# EAGLE design probe (EAGLE 6.6.0)
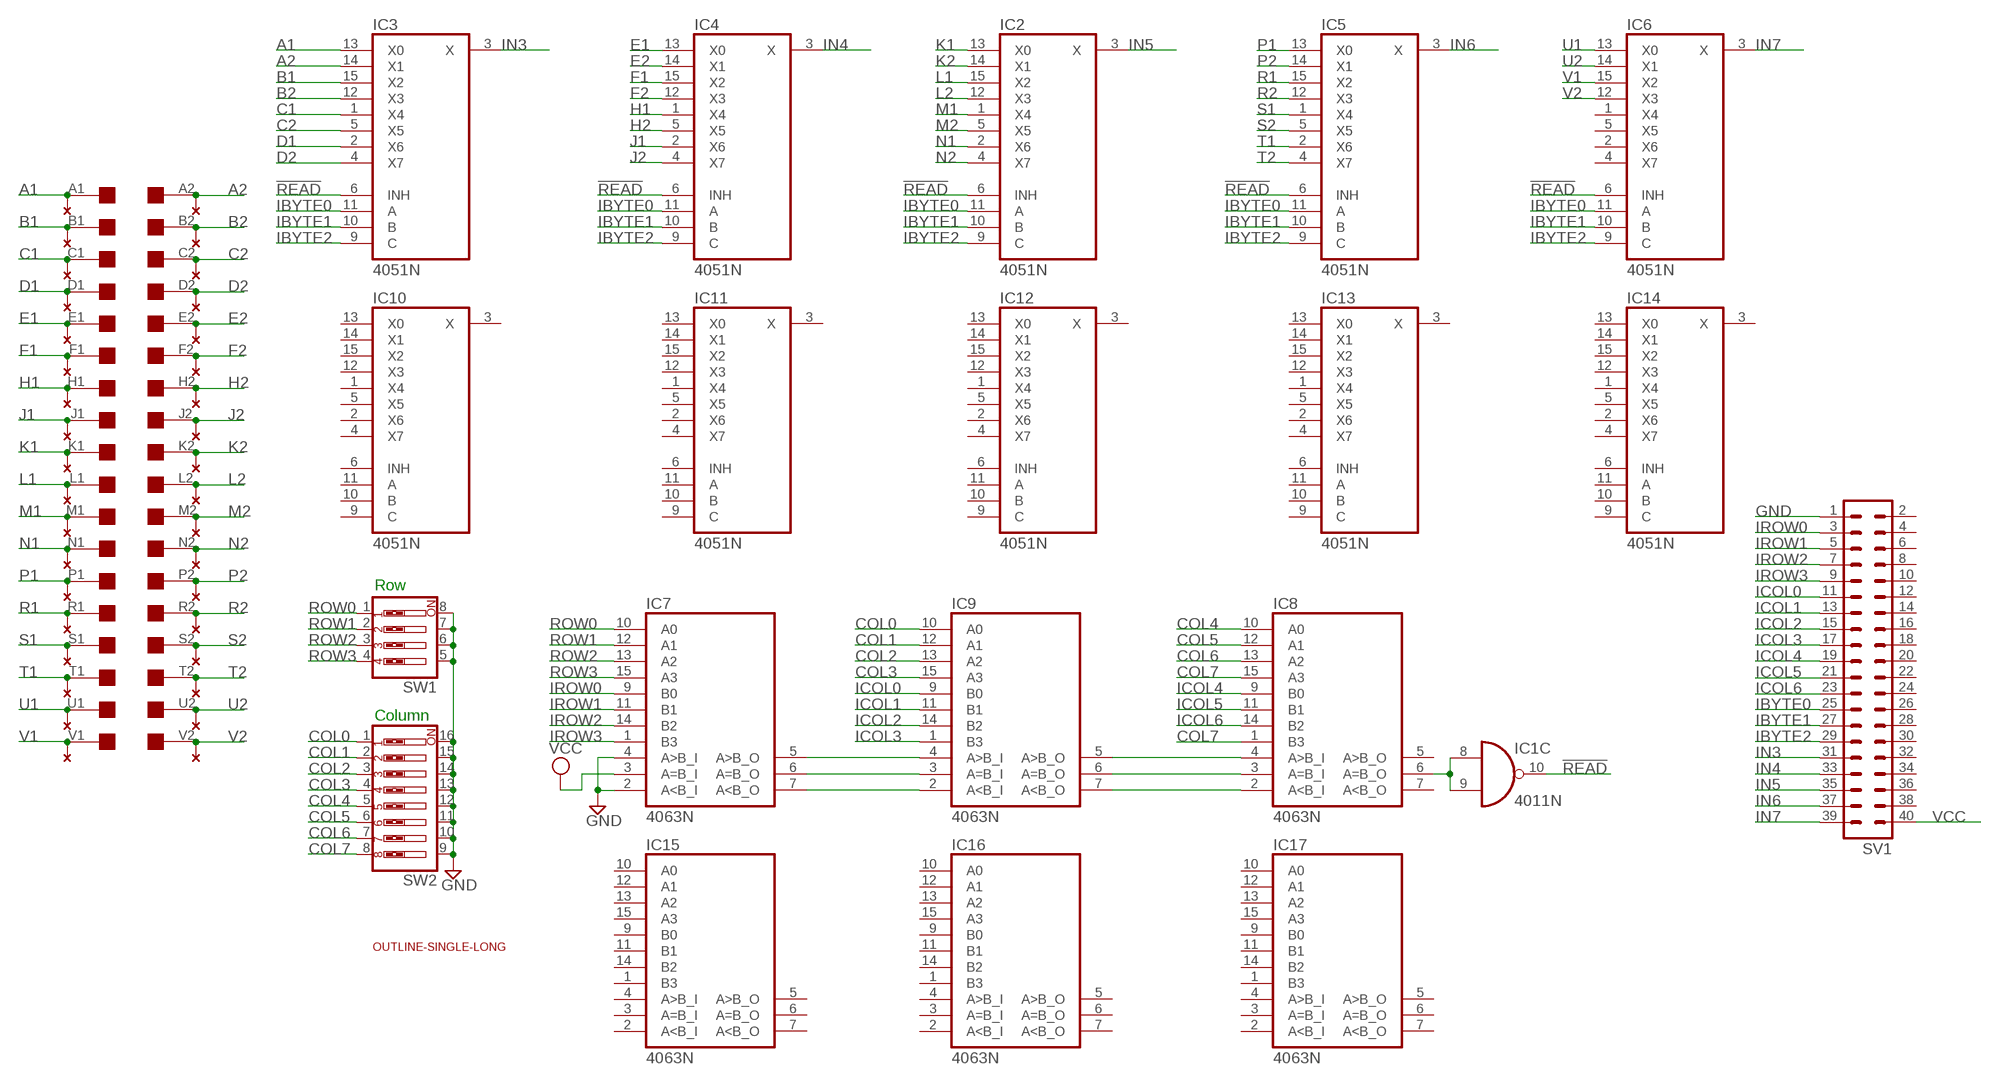
[diagram p0: schematic, sheet 1]

## Parts
EDGE1  EDGE-2CONNECTOR  [EDGE-CON2]
IC1  4011N  [DIL14]
IC2  4051N  [DIL16]
IC3  4051N  [DIL16]
IC4  4051N  [DIL16]
IC5  4051N  [DIL16]
IC6  4051N  [DIL16]
IC7  4063N  [DIL16]
IC8  4063N  [DIL16]
IC9  4063N  [DIL16]
IC10  4051N  [DIL16]
IC11  4051N  [DIL16]
IC12  4051N  [DIL16]
IC13  4051N  [DIL16]
IC14  4051N  [DIL16]
IC15  4063N  [DIL16]
IC16  4063N  [DIL16]
IC17  4063N  [DIL16]
SV1  MA20-2  [MA20-2]
SW1  SW_DIP-4  [EDG-04]
SW2  SW_DIP-8  [EDG-08]
U$1  OUTLINE-SINGLE-LONG  [SINGLE-LONG]
U$3  THRU-HOLE2  [THRU-HOLEB]

## Nets
!READ: IC1.10(C:O) IC2.6(INH) IC3.6(INH) IC4.6(INH) IC5.6(INH) IC6.6(INH)
A1: EDGE1.A1 IC3.13(X0) U$3.A1
A2: EDGE1.A2 IC3.14(X1) U$3.A2
B1: EDGE1.B1 IC3.15(X2) U$3.B1
B2: EDGE1.B2 IC3.12(X3) U$3.B2
C1: EDGE1.C1 IC3.1(X4) U$3.C1
C2: EDGE1.C2 IC3.5(X5) U$3.C2
COL0: IC9.10(A0) SW2.1
COL1: IC9.12(A1) SW2.2
COL2: IC9.13(A2) SW2.3
COL3: IC9.15(A3) SW2.4
COL4: IC8.10(A0) SW2.5
COL5: IC8.12(A1) SW2.6
COL6: IC8.13(A2) SW2.7
COL7: IC8.1(B3) IC8.15(A3) SW2.8
D1: EDGE1.D1 IC3.2(X6) U$3.D1
D2: EDGE1.D2 IC3.4(X7) U$3.D2
E1: EDGE1.E1 IC4.13(X0) U$3.E1
E2: EDGE1.E2 IC4.14(X1) U$3.E2
F1: EDGE1.F1 IC4.15(X2) U$3.F1
F2: EDGE1.F2 IC4.12(X3) U$3.F2
GND: IC7.2(A<B_I) IC7.4(A>B_I) SV1.1 SW1.5 SW1.6 SW1.7 SW1.8 SW2.9 SW2.10 SW2.11 SW2.12 SW2.13 SW2.14 SW2.15 SW2.16
H1: EDGE1.H1 IC4.1(X4) U$3.H1
H2: EDGE1.H2 IC4.5(X5) U$3.H2
IBYTE0: IC2.11(A) IC3.11(A) IC4.11(A) IC5.11(A) IC6.11(A) SV1.25
IBYTE1: IC2.10(B) IC3.10(B) IC4.10(B) IC5.10(B) IC6.10(B) SV1.27
IBYTE2: IC2.9(C) IC3.9(C) IC4.9(C) IC5.9(C) IC6.9(C) SV1.29
ICOL0: IC9.9(B0) SV1.11
ICOL1: IC9.11(B1) SV1.13
ICOL2: IC9.14(B2) SV1.15
ICOL3: IC9.1(B3) SV1.17
ICOL4: IC8.9(B0) SV1.19
ICOL5: IC8.11(B1) SV1.21
ICOL6: IC8.14(B2) SV1.23
IN3: IC3.3(X) SV1.31
IN4: IC4.3(X) SV1.33
IN5: IC2.3(X) SV1.35
IN6: IC5.3(X) SV1.37
IN7: IC6.3(X) SV1.39
IROW0: IC7.9(B0) SV1.3
IROW1: IC7.11(B1) SV1.5
IROW2: IC7.14(B2) SV1.7
IROW3: IC7.1(B3) SV1.9
J1: EDGE1.J1 IC4.2(X6) U$3.J1
J2: EDGE1.J2 IC4.4(X7) U$3.J2
K1: EDGE1.K1 IC2.13(X0) U$3.K1
K2: EDGE1.K2 IC2.14(X1) U$3.K2
L1: EDGE1.L1 IC2.15(X2) U$3.L1
L2: EDGE1.L2 IC2.12(X3) U$3.L2
M1: EDGE1.M1 IC2.1(X4) U$3.M1
M2: EDGE1.M2 IC2.5(X5) U$3.M2
N1: EDGE1.N1 IC2.2(X6) U$3.N1
N2: EDGE1.N2 IC2.4(X7) U$3.N2
N$1: IC7.5(A>B_O) IC9.4(A>B_I)
N$2: IC7.6(A=B_O) IC9.3(A=B_I)
N$3: IC7.7(A<B_O) IC9.2(A<B_I)
N$4: IC1.8(C:I0) IC1.9(C:I1) IC8.6(A=B_O)
N$5: IC8.4(A>B_I) IC9.5(A>B_O)
N$6: IC8.3(A=B_I) IC9.6(A=B_O)
N$7: IC8.2(A<B_I) IC9.7(A<B_O)
P1: EDGE1.P1 IC5.13(X0) U$3.P1
P2: EDGE1.P2 IC5.14(X1) U$3.P2
R1: EDGE1.R1 IC5.15(X2) U$3.R1
R2: EDGE1.R2 IC5.12(X3) U$3.R2
ROW0: IC7.10(A0) SW1.1
ROW1: IC7.12(A1) SW1.2
ROW2: IC7.13(A2) SW1.3
ROW3: IC7.15(A3) SW1.4
S1: EDGE1.S1 IC5.1(X4) U$3.S1
S2: EDGE1.S2 IC5.5(X5) U$3.S2
T1: EDGE1.T1 IC5.2(X6) U$3.T1
T2: EDGE1.T2 IC5.4(X7) U$3.T2
U1: EDGE1.U1 IC6.13(X0) U$3.U1
U2: EDGE1.U2 IC6.14(X1) U$3.U2
V1: EDGE1.V1 IC6.15(X2) U$3.V1
V2: EDGE1.V2 IC6.12(X3) U$3.V2
VCC: IC7.3(A=B_I) SV1.40
Unconnected: IC1.1(A:I0) IC1.2(A:I1) IC1.3(A:O) IC1.4(B:O) IC1.5(B:I0) IC1.6(B:I1) IC1.11(D:O) IC1.12(D:I0) IC1.13(D:I1) IC6.1(X4) IC6.2(X6) IC6.4(X7) IC6.5(X5) IC8.5(A>B_O) IC8.7(A<B_O) IC10.1(X4) IC10.2(X6) IC10.3(X) IC10.4(X7) IC10.5(X5) IC10.6(INH) IC10.9(C) IC10.10(B) IC10.11(A) IC10.12(X3) IC10.13(X0) IC10.14(X1) IC10.15(X2) IC11.1(X4) IC11.2(X6) IC11.3(X) IC11.4(X7) IC11.5(X5) IC11.6(INH) IC11.9(C) IC11.10(B) IC11.11(A) IC11.12(X3) IC11.13(X0) IC11.14(X1) IC11.15(X2) IC12.1(X4) IC12.2(X6) IC12.3(X) IC12.4(X7) IC12.5(X5) IC12.6(INH) IC12.9(C) IC12.10(B) IC12.11(A) IC12.12(X3) IC12.13(X0) IC12.14(X1) IC12.15(X2) IC13.1(X4) IC13.2(X6) IC13.3(X) IC13.4(X7) IC13.5(X5) IC13.6(INH) IC13.9(C) IC13.10(B) IC13.11(A) IC13.12(X3) IC13.13(X0) IC13.14(X1) IC13.15(X2) IC14.1(X4) IC14.2(X6) IC14.3(X) IC14.4(X7) IC14.5(X5) IC14.6(INH) IC14.9(C) IC14.10(B) IC14.11(A) IC14.12(X3) IC14.13(X0) IC14.14(X1) IC14.15(X2) IC15.1(B3) IC15.2(A<B_I) IC15.3(A=B_I) IC15.4(A>B_I) IC15.5(A>B_O) IC15.6(A=B_O) IC15.7(A<B_O) IC15.9(B0) IC15.10(A0) IC15.11(B1) IC15.12(A1) IC15.13(A2) IC15.14(B2) IC15.15(A3) IC16.1(B3) IC16.2(A<B_I) IC16.3(A=B_I) IC16.4(A>B_I) IC16.5(A>B_O) IC16.6(A=B_O) IC16.7(A<B_O) IC16.9(B0) IC16.10(A0) IC16.11(B1) IC16.12(A1) IC16.13(A2) IC16.14(B2) IC16.15(A3) IC17.1(B3) IC17.2(A<B_I) IC17.3(A=B_I) IC17.4(A>B_I) IC17.5(A>B_O) IC17.6(A=B_O) IC17.7(A<B_O) IC17.9(B0) IC17.10(A0) IC17.11(B1) IC17.12(A1) IC17.13(A2) IC17.14(B2) IC17.15(A3) SV1.2 SV1.4 SV1.6 SV1.8 SV1.10 SV1.12 SV1.14 SV1.16 SV1.18 SV1.20 SV1.22 SV1.24 SV1.26 SV1.28 SV1.30 SV1.32 SV1.34 SV1.36 SV1.38

## Notes on the sheet
- Row
- Column

## Power pins joined to a net without a drawn wire
GND: IC2.8(GND) IC3.8(GND) IC4.8(GND) IC5.8(GND) IC6.8(GND) IC10.8(GND) IC11.8(GND) IC12.8(GND) IC13.8(GND) IC14.8(GND)
VCC: IC2.16(VCC) IC3.16(VCC) IC4.16(VCC) IC5.16(VCC) IC6.16(VCC) IC10.16(VCC) IC11.16(VCC) IC12.16(VCC) IC13.16(VCC) IC14.16(VCC)
VDD: IC1.14(P:VDD) IC7.16(VDD) IC8.16(VDD) IC9.16(VDD) IC15.16(VDD) IC16.16(VDD) IC17.16(VDD)
VEE: IC2.7(VEE) IC3.7(VEE) IC4.7(VEE) IC5.7(VEE) IC6.7(VEE) IC10.7(VEE) IC11.7(VEE) IC12.7(VEE) IC13.7(VEE) IC14.7(VEE)
VSS: IC1.7(P:VSS) IC7.8(VSS) IC8.8(VSS) IC9.8(VSS) IC15.8(VSS) IC16.8(VSS) IC17.8(VSS)

## Library data of the parts
EDGE1 = dec-con:EDGE-2: Double-Sided DEC edge connector.
IC1 = 40xx:4011: Quad 2-input NAND
IC2-IC6 IC10-IC14 = 40xx:4051: 8-channel ANALOG MULTIPLEXER
IC7-IC9 IC15-IC17 = 40xx:4063: 4-bit magnitude COMPARATOR
SV1 = con-lstb:MA20-2: PIN HEADER; OC_FARNELL: unknown; OC_NEWARK: unknown
SW1 = special:SW_DIP-4: DIP SWITCH
SW2 = special:SW_DIP-8: DIP SWITCH
U$1 = dec-con:OUTLINE-*: Board outlines for DEC boards.
U$3 = dec-con:THRU-HOLE2: Thru-Hole addition to double-sided edge connector.

## Board
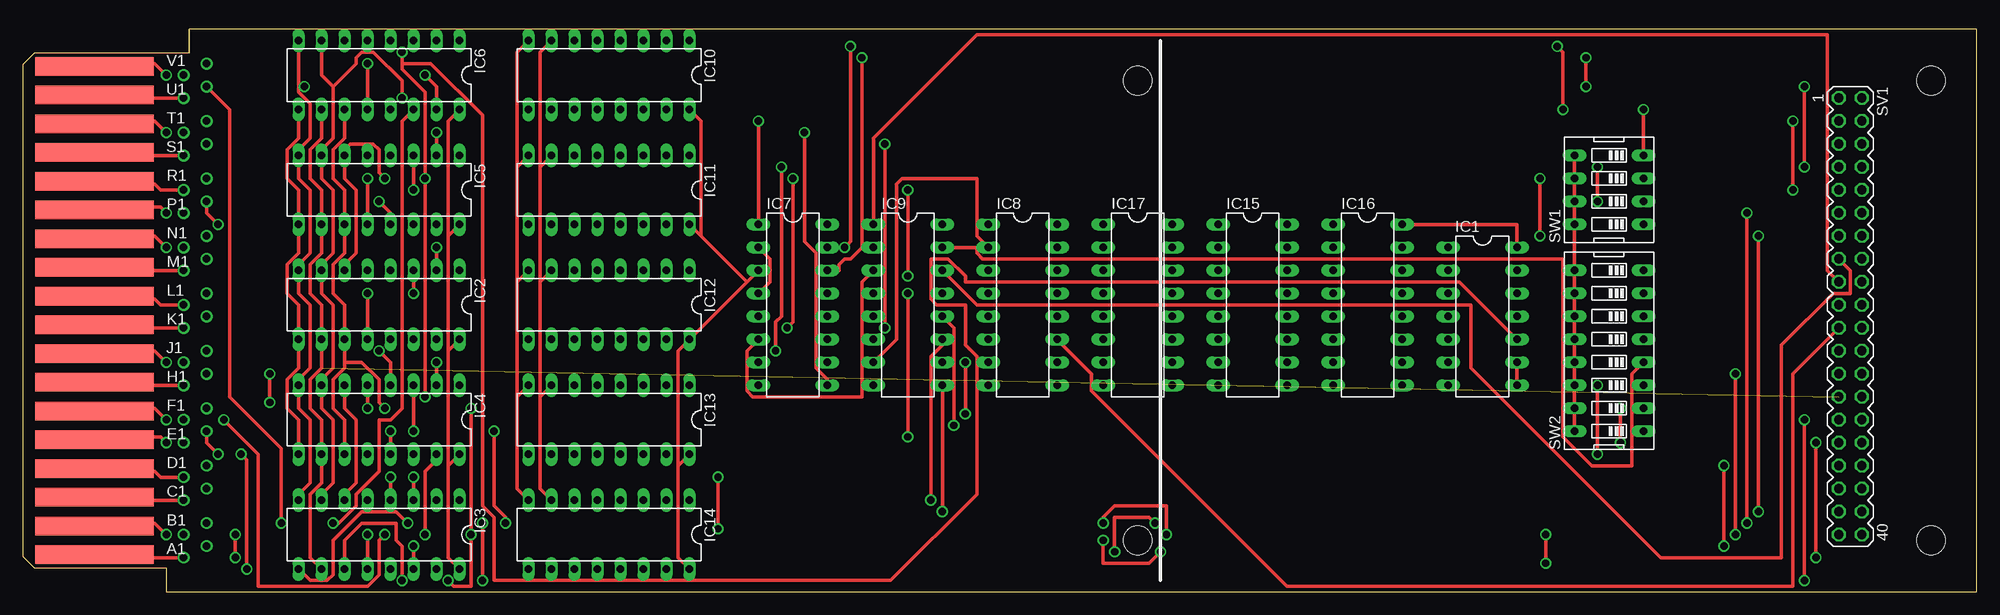
[diagram p1: board, top side]
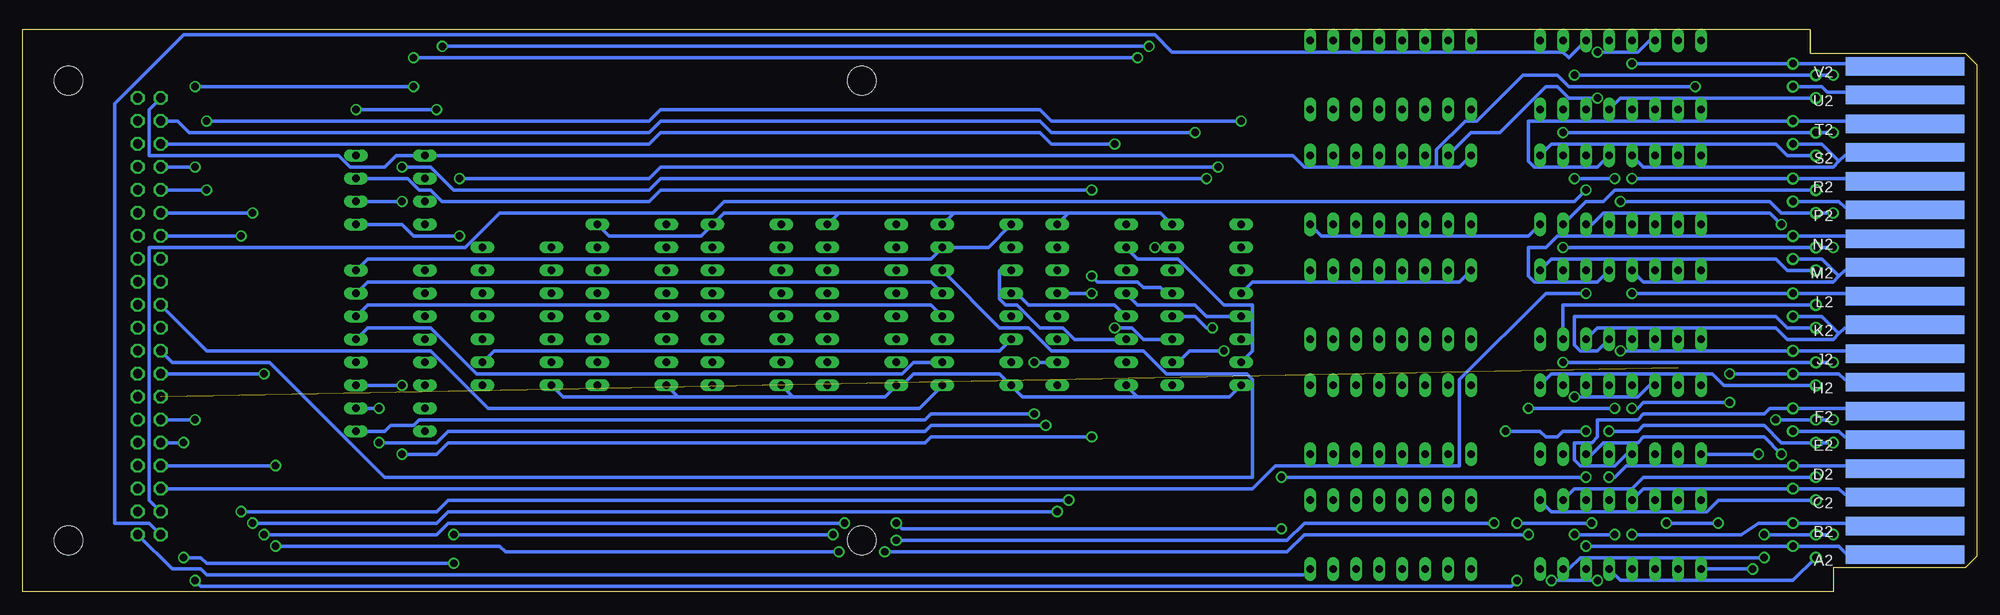
[diagram p2: board, bottom side, seen from below]

Size 215.9 x 62.23 mm. Coordinates in mm from the lower left corner, seen from the top.
Copper layers (1+16): Top 0.035mm / dielectric 1.5mm / Bottom 0.035mm
Design rules "16mils": minimum track width 16mil, minimum drill 32mil, track to track 15mil, track to pad 10mil, pad to pad 10mil, via to via 10mil, smd to smd 10mil, copper to edge 13mil, drill to drill 10mil, minimum pad ring 10mil, minimum via ring 8mil, stop-mask expansion 0mil, vias tented up to drill 0mil, thermal gap 10mil
Holes 3.17 mm at 123.19,56.52 123.19,5.71

### Footprints (pad centres in the part's own frame; a part is rotated, then mirrored left to right if it is on the bottom)
EDGE-CON2 = smd 13.106 x 2.032: A1 7.938,4.128; B1 7.938,7.303; C1 7.938,10.477; D1 7.938,13.652; E1 7.938,16.828; F1 7.938,20.003; H1 7.938,23.177; J1 7.938,26.352; K1 7.938,29.527; L1 7.938,32.703; M1 7.938,35.877; N1 7.938,39.053; P1 7.938,42.227; R1 7.938,45.403; S1 7.938,48.578; T1 7.938,51.752; U1 7.938,54.928; V1 7.938,58.102 | smd 13.106 x 2.032 bottom: A2 7.938,4.128; B2 7.938,7.303; C2 7.938,10.477; D2 7.938,13.652; E2 7.938,16.828; F2 7.938,20.003; H2 7.938,23.177; J2 7.938,26.352; K2 7.938,29.527; L2 7.938,32.703; M2 7.938,35.877; N2 7.938,39.053; P2 7.938,42.227; R2 7.938,45.403; S2 7.938,48.578; T2 7.938,51.752; U2 7.938,54.928; V2 7.938,58.102
DIL14 = drill 0.813 long: 1 -7.62,-3.81; 2 -5.08,-3.81; 3 -2.54,-3.81; 4 0,-3.81; 5 2.54,-3.81; 6 5.08,-3.81; 7 7.62,-3.81; 8 7.62,3.81; 9 5.08,3.81; 10 2.54,3.81; 11 0,3.81; 12 -2.54,3.81; 13 -5.08,3.81; 14 -7.62,3.81
DIL16 = drill 0.813 long: 1 -8.89,-3.81; 2 -6.35,-3.81; 3 -3.81,-3.81; 4 -1.27,-3.81; 5 1.27,-3.81; 6 3.81,-3.81; 7 6.35,-3.81; 8 8.89,-3.81; 9 8.89,3.81; 10 6.35,3.81; 11 3.81,3.81; 12 1.27,3.81; 13 -1.27,3.81; 14 -3.81,3.81; 15 -6.35,3.81; 16 -8.89,3.81
MA20-2 = drill 1.016 octagon: 1 -24.13,-1.27; 2 -24.13,1.27; 3 -21.59,-1.27; 4 -21.59,1.27; 5 -19.05,-1.27; 6 -19.05,1.27; 7 -16.51,-1.27; 8 -16.51,1.27; 9 -13.97,-1.27; 10 -13.97,1.27; 11 -11.43,-1.27; 12 -11.43,1.27; 13 -8.89,-1.27; 14 -8.89,1.27; 15 -6.35,-1.27; 16 -6.35,1.27; 17 -3.81,-1.27; 18 -3.81,1.27; 19 -1.27,-1.27; 20 -1.27,1.27; 21 1.27,-1.27; 22 1.27,1.27; 23 3.81,-1.27; 24 3.81,1.27; 25 6.35,-1.27; 26 6.35,1.27; 27 8.89,-1.27; 28 8.89,1.27; 29 11.43,-1.27; 30 11.43,1.27; 31 13.97,-1.27; 32 13.97,1.27; 33 16.51,-1.27; 34 16.51,1.27; 35 19.05,-1.27; 36 19.05,1.27; 37 21.59,-1.27; 38 21.59,1.27; 39 24.13,-1.27; 40 24.13,1.27
EDG-04 = drill 0.813 long: 1 -3.81,-3.81; 2 -1.27,-3.81; 3 1.27,-3.81; 4 3.81,-3.81; 5 3.81,3.81; 6 1.27,3.81; 7 -1.27,3.81; 8 -3.81,3.81
EDG-08 = drill 0.813 long: 1 -8.89,-3.81; 2 -6.35,-3.81; 3 -3.81,-3.81; 4 -1.27,-3.81; 5 1.27,-3.81; 6 3.81,-3.81; 7 6.35,-3.81; 8 8.89,-3.81; 9 8.89,3.81; 10 6.35,3.81; 11 3.81,3.81; 12 1.27,3.81; 13 -1.27,3.81; 14 -3.81,3.81; 15 -6.35,3.81; 16 -8.89,3.81
SINGLE-LONG = hole 3.175: 210.82,56.515; 210.82,5.715
THRU-HOLEB = drill 0.813 pad 1.27: A1 17.78,3.81; A2 20.32,5.08; B1 17.78,6.35; B2 20.32,7.62; C1 17.78,10.16; C2 20.32,11.43; D1 17.78,12.7; D2 20.32,13.97; E1 17.78,16.51; E2 20.32,17.78; F1 17.78,19.05; F2 20.32,20.32; H1 17.78,22.86; H2 20.32,24.13; J1 17.78,25.4; J2 20.32,26.67; K1 17.78,29.21; K2 20.32,30.48; L1 17.78,31.75; L2 20.32,33.02; M1 17.78,35.56; M2 20.32,36.83; N1 17.78,38.1; N2 20.32,39.37; P1 17.78,41.91; P2 20.32,43.18; R1 17.78,44.45; R2 20.32,45.72; S1 17.78,48.26; S2 20.32,49.53; T1 17.78,50.8; T2 20.32,52.07; U1 17.78,54.61; U2 20.32,55.88; V1 17.78,57.15; V2 20.32,58.42

### Placement (x,y rotation side)
EDGE1  0,0 0 top
IC1  161.29,30.48 270 top
IC2  39.37,31.75 180 top
IC3  39.37,6.35 180 top
IC4  39.37,19.05 180 top
IC5  39.37,44.45 180 top
IC6  39.37,57.15 180 top
IC7  85.09,31.75 270 top
IC8  110.49,31.75 270 top
IC9  97.79,31.75 270 top
IC10  64.77,57.15 180 top
IC11  64.77,44.45 180 top
IC12  64.77,31.75 180 top
IC13  64.77,19.05 180 top
IC14  64.77,6.35 180 top
IC15  135.89,31.75 270 top
IC16  148.59,31.75 270 top
IC17  123.19,31.75 270 top
SV1  201.93,30.48 270 top
SW1  175.26,44.45 90 top
SW2  175.26,26.67 90 top
U$1  0,0 0 top
U$3  0,0 0 top

### Tracks (layer width: path | path; a pad name or v marks a point on that pad's centre or on a via)
!READ  (via drill 0.81)
  Top 0.406: IC3.6 35.56,10.79 36.83,12.06 36.83,19.05 35.56,20.32 IC4.6 | IC2.6 35.56,36.2 36.83,37.47 36.83,44.45 35.56,45.72 IC5.6 35.56,48.9 36.2,49.53 38.74,49.53 39.37,48.9 39.37,46.35 v40.01,45.72 | 41.91,58.42 41.91,57.78 44.45,55.24 v44.45,45.72 v44.45,21.59 | 41.91,58.42 v41.91,59.69 | IC1.10 158.75,34.29 104.14,34.29 104.14,34.92 102.24,36.83 100.33,36.83 100.33,32.38 100.97,31.75 104.14,31.75 104.14,27.3 105.41,26.04 105.41,10.79 95.89,1.27 52.07,1.27 52.07,8.26 50.8,9.53 50.8,52.7 45.09,58.42 41.91,58.42
  Bottom 0.406: IC6.6 36.2,60.96 37.47,59.69 v41.91,59.69 | v40.01,45.72 v44.45,45.72 | IC4.6 36.2,22.86 37.47,21.59 v44.45,21.59
A1
  Top 0.406: U$3.A1 8.26,3.81 EDGE1.A1
  Bottom 0.406: IC3.13 39.37,1.27 20.32,1.27 U$3.A1
A2  (via drill 0.81)
  Top 0.406: v43.18,5.08 IC3.14
  Bottom 0.406: EDGE1.A2 8.26,3.81 13.97,3.81 15.24,5.08 U$3.A2 v43.18,5.08
B1  (via drill 0.81)
  Top 0.406: v15.88,6.35 14.61,7.62 8.26,7.62 EDGE1.B1 | v23.5,6.35 v23.5,3.81
  Bottom 0.406: v15.88,6.35 U$3.B1 v23.5,6.35 | IC3.15 45.09,2.54 43.82,3.81 v23.5,3.81
B2  (via drill 0.81)
  Top 0.406: v38.1,6.35 IC3.12
  Bottom 0.406: EDGE1.B2 8.26,7.62 U$3.B2 24.13,7.62 26.04,6.35 v38.1,6.35
C1
  Top 0.406: U$3.C1 8.26,10.16 EDGE1.C1
  Bottom 0.406: IC3.1 46.99,8.89 29.85,8.89 28.58,10.16 U$3.C1
C2
  Bottom 0.406: IC3.5 36.83,11.43 U$3.C2 15.24,11.43 14.61,10.79 8.26,10.79 EDGE1.C2
COL0  (via drill 0.81)
  Top 0.406: v104.14,19.68 v104.14,25.4
  Bottom 0.406: v104.14,25.4 IC9.10 | v104.14,19.68 115.57,19.68 116.21,19.05 172.09,19.05 172.72,18.41 175.26,18.41 175.9,17.78 SW2.1
COL1  (via drill 0.81)
  Top 0.406: IC9.12 102.87,29.21 v102.87,18.41 | v176.53,20.32 v176.53,16.51
  Bottom 0.406: v102.87,18.41 115.57,18.41 116.21,17.78 168.91,17.78 170.18,16.51 v176.53,16.51 | SW2.2 v176.53,20.32
COL2  (via drill 0.81)
  Top 0.406: v97.79,17.14 v97.79,33.02 | v173.99,22.86 v173.99,15.24
  Bottom 0.406: v97.79,33.02 IC9.13 | v97.79,17.14 115.57,17.14 116.21,16.51 168.91,16.51 170.18,15.24 v173.99,15.24 | SW2.3 v173.99,22.86
COL3
  Top 0.406: IC9.15 105.41,38.1 105.41,37.47 106.05,36.83 170.18,36.83 170.18,17.14 173.36,13.97 177.8,13.97 177.8,24.13 SW2.4
COL4
  Bottom 0.406: IC8.10 117.48,25.4 118.75,24.13 165.74,24.13 170.82,29.21 177.8,29.21 SW2.5
COL5
  Bottom 0.406: IC8.12 115.57,31.75 177.8,31.75 SW2.6
COL6
  Bottom 0.406: IC8.13 115.57,34.29 177.8,34.29 SW2.7
COL7
  Bottom 0.406: IC8.1 109.22,38.1 IC8.15 115.57,36.83 177.8,36.83 SW2.8
D1
  Top 0.406: U$3.D1 15.24,12.7 14.61,13.34 8.26,13.34 EDGE1.D1
  Bottom 0.406: IC3.2 44.45,11.43 38.1,11.43 36.83,12.7 U$3.D1
D2  (via drill 0.81)
  Top 0.406: v40.64,12.7 IC3.4
  Bottom 0.406: EDGE1.D2 8.26,13.97 U$3.D2 38.74,13.97 40.01,12.7 v40.64,12.7
E1  (via drill 0.81)
  Top 0.406: v15.88,16.51 15.24,17.14 8.26,17.14 EDGE1.E1 | v40.64,17.78 IC4.13
  Bottom 0.406: v15.88,16.51 U$3.E1 21.59,16.51 23.5,18.41 36.83,18.41 37.47,17.78 v40.64,17.78
E2  (via drill 0.81)
  Top 0.406: v21.59,15.24 20.32,16.51 U$3.E2
  Bottom 0.406: U$3.E2 15.24,17.78 14.61,17.14 8.26,17.14 EDGE1.E2 | IC4.14 42.55,15.24 41.28,16.51 37.47,16.51 36.83,17.14 23.5,17.14 v21.59,15.24
F1  (via drill 0.81)
  Top 0.406: v15.88,19.05 14.61,20.32 8.26,20.32 EDGE1.F1 | IC4.15 45.72,14.61 44.45,13.34 v44.45,6.35 | v40.01,6.35 39.37,5.71 39.37,1.91 38.1,0.64 26.04,0.64 26.04,15.24 v22.23,19.05
  Bottom 0.406: v15.88,19.05 U$3.F1 v22.23,19.05 | v40.01,6.35 v44.45,6.35
F2
  Bottom 0.406: IC4.12 38.74,15.24 40.01,13.97 43.82,13.97 44.45,14.61 44.45,16.51 42.55,16.51 41.91,17.14 41.91,19.05 37.47,19.05 36.83,19.68 23.5,19.68 22.86,20.32 U$3.F2 8.26,20.32 EDGE1.F2
GND  (via drill 0.81)
  Top 0.406: IC3.8 30.48,10.79 31.75,12.06 31.75,19.05 30.48,20.32 IC4.8 30.48,23.5 31.75,24.77 31.75,31.75 30.48,33.02 IC2.8 30.48,36.2 31.75,37.47 31.75,44.45 30.48,45.72 IC5.8 30.48,48.9 31.75,50.16 31.75,53.98 30.48,55.24 30.48,55.88 | 30.48,55.88 IC6.8 | v31.12,55.88 30.48,55.88 | SW2.16 SW2.15 SW2.14 SW2.13 SW2.12 SW2.11 SW2.10 SW2.9 SW1.8 SW1.7 SW1.6 SW1.5 | IC7.4 82.55,34.29 82.55,36.83 IC7.2 | IC14.8 54.61,11.43 54.61,21.59 | IC13.8 54.61,21.59 | 54.61,34.29 IC12.8 | 54.61,21.59 54.61,34.29 | 54.61,46.99 IC11.8 | 54.61,34.29 54.61,46.99 | IC10.8 54.61,59.69 54.61,46.99
  Bottom 0.406: v31.12,55.88 45.09,55.88 46.36,57.15 50.17,57.15 55.25,52.07 56.52,52.07 59.69,48.9 59.69,46.99 | SV1.1 201.93,53.34 201.93,48.26 180.98,48.26 179.71,46.99 175.9,46.99 174.63,48.26 SW1.5 75.57,48.26 74.3,46.99 59.69,46.99 | IC7.4 80.01,34.29 57.15,34.29 IC12.8 | 59.69,46.99 57.15,46.99 IC11.8
H1
  Top 0.406: U$3.H1 8.26,22.86 EDGE1.H1
  Bottom 0.406: IC4.1 46.99,24.13 29.21,24.13 27.94,22.86 U$3.H1
H2  (via drill 0.81)
  Top 0.406: v38.1,20.32 IC4.5 | v27.31,24.13 v27.31,20.95
  Bottom 0.406: EDGE1.H2 8.26,23.5 14.61,23.5 15.24,24.13 U$3.H2 v27.31,24.13 | v38.1,20.32 37.47,20.32 36.83,20.95 v27.31,20.95
IBYTE0  (via drill 0.81)
  Top 0.406: IC6.11 35.56,50.16 34.29,48.9 34.29,45.72 35.56,44.45 IC5.11 35.56,37.47 34.29,36.2 34.29,33.02 35.56,31.75 IC2.11 35.56,25.4 | IC3.11 35.56,5.71 37.47,7.62 41.28,7.62 41.28,5.71 41.91,5.08 v41.91,1.27 | v46.99,1.27 47.63,0.64 49.53,0.64 v49.53,6.35 v49.53,20.32 | v40.01,20.32 39.37,20.95 39.37,23.5 37.47,25.4 35.56,25.4 | IC4.11 35.56,19.05 34.29,20.32 34.29,23.5 35.56,24.77 35.56,25.4 | v189.23,6.35 v189.23,24.13 | v125.1,7.62 124.46,8.26 120.65,8.26 v120.65,4.45
  Bottom 0.406: v46.99,1.27 v41.91,1.27 | v40.01,20.32 v49.53,20.32 | v189.23,24.13 SV1.25 | v189.23,6.35 170.18,6.35 168.91,7.62 v125.1,7.62 | v120.65,4.45 76.2,4.45 74.3,6.35 v49.53,6.35
IBYTE1  (1 unrouted)
  Top 0.406: IC6.10 33.02,50.16 31.75,48.9 31.75,45.72 33.02,44.45 IC5.10 33.02,37.47 31.75,36.2 31.75,33.02 33.02,31.75 IC2.10 33.02,24.77 31.75,23.5 31.75,20.32 33.02,19.05 IC4.10 33.02,12.06 31.75,10.79 31.75,3.81 IC3.10
IBYTE2  (via drill 0.81)
  Top 0.406: v24.77,2.54 24.77,14.61 v24.13,15.24 | IC4.9 30.48,19.05 29.21,20.32 29.21,23.5 30.48,24.77 IC2.9 30.48,31.75 29.21,33.02 29.21,36.2 30.48,37.47 IC5.9 30.48,44.45 29.21,45.72 29.21,48.9 30.48,50.16 IC6.9 | v196.85,1.27 v196.85,19.05 | v50.8,7.62 v50.8,1.27 | v42.55,7.62 41.28,8.89 37.47,8.89 34.29,5.71 34.29,1.91 33.66,1.27 31.75,1.27 IC3.9
  Bottom 0.406: v24.77,2.54 IC3.9 | IC4.9 v24.13,15.24 | v196.85,19.05 SV1.29 | v196.85,1.27 196.22,0.64 51.44,0.64 v50.8,1.27 | v42.55,7.62 v50.8,7.62
ICOL0  (via drill 0.81)
  Top 0.406: v101.6,8.89 IC9.9 | v190.5,41.91 v190.5,7.62
  Bottom 0.406: v101.6,8.89 168.91,8.89 170.18,7.62 v190.5,7.62 | SV1.11 v190.5,41.91
ICOL1  (via drill 0.81)
  Top 0.406: IC9.11 101.6,27.3 100.33,26.04 v100.33,10.16 | v191.77,39.37 v191.77,8.89
  Bottom 0.406: v100.33,10.16 168.91,10.16 170.18,8.89 v191.77,8.89 | SV1.13 v191.77,39.37
ICOL2
  Top 0.406: IC9.14 105.41,31.75 160.02,31.75 160.02,24.77 180.98,3.81 194.31,3.81 194.31,27.3 200.03,33.02 201.93,33.02 201.93,35.56 SV1.15
ICOL3
  Top 0.406: IC9.1 93.98,50.16 105.41,61.59 199.39,61.59 199.39,35.56 SV1.17
ICOL4
  Bottom 0.406: IC8.9 116.84,20.32 164.47,20.32 170.82,26.67 195.58,26.67 SV1.19
ICOL5
  Top 0.406: IC8.11 118.11,24.13 118.11,22.23 139.7,0.64 195.58,0.64 195.58,24.13 SV1.21
ICOL6
  Bottom 0.406: IC8.14 107.95,29.21 104.78,29.21 102.24,26.67 92.08,26.67 89.54,24.13 80.65,24.13 80.01,23.5 80.01,12.7 175.9,12.7 188.6,25.4 199.39,25.4 SV1.23
IN3  (via drill 0.81)
  Top 0.406: v43.18,12.7 IC3.3 | v76.84,6.99 v76.84,12.7 | v119.38,7.62 119.38,8.26 120.65,9.53 126.37,9.53 v126.37,6.35 | v168.28,3.17 v168.28,6.35 | v198.12,16.51 v198.12,3.81
  Bottom 0.406: v76.84,12.7 v43.18,12.7 | v76.84,6.99 118.75,6.99 v119.38,7.62 | v168.28,6.35 v126.37,6.35 | v168.28,3.17 195.58,3.17 196.22,3.81 v198.12,3.81 | SV1.31 v198.12,16.51
IN4  (via drill 0.81)
  Top 0.406: v43.18,17.78 IC4.3 | v187.96,5.08 v187.96,13.97 | v125.73,4.45 124.46,3.17 119.38,3.17 v119.38,5.71 | v53.34,7.62 53.34,8.26 52.07,9.53 v52.07,17.78
  Bottom 0.406: v43.18,17.78 45.72,17.78 46.36,17.14 47.63,17.14 48.26,17.78 v52.07,17.78 | v187.96,13.97 SV1.33 | v187.96,5.08 163.2,5.08 162.56,4.45 v125.73,4.45 | v119.38,5.71 76.2,5.71 74.3,7.62 v53.34,7.62
IN5  (via drill 0.81)
  Top 0.406: v43.18,33.02 IC2.3
  Bottom 0.406: v43.18,33.02 47.63,33.02 57.15,23.5 57.15,13.97 77.47,13.97 80.01,11.43 SV1.35
IN6  (via drill 0.81)
  Top 0.406: v43.18,44.45 IC5.3
  Bottom 0.406: SV1.37 201.93,10.16 201.93,38.1 167.01,38.1 163.2,41.91 139.7,41.91 138.43,43.18 44.45,43.18 v43.18,44.45
IN7
  Bottom 0.406: IC6.3 45.09,59.05 45.72,59.69 88.9,59.69 90.81,61.59 198.12,61.59 205.74,53.98 205.74,7.62 201.93,7.62 SV1.39
IROW0  (via drill 0.81)
  Top 0.406: IC7.9 88.9,23.5 87.63,24.77 87.63,37.47 86.36,38.73 v86.36,50.8
  Bottom 0.406: v86.36,50.8 102.24,50.8 103.51,52.07 145.42,52.07 146.69,50.8 197.49,50.8 198.76,52.07 SV1.3
IROW1  (via drill 0.81)
  Top 0.406: v95.25,49.53 v95.25,29.21
  Bottom 0.406: IC7.11 92.08,27.94 93.35,29.21 v95.25,29.21 | v95.25,49.53 102.24,49.53 103.51,50.8 145.42,50.8 146.69,49.53 SV1.5
IROW2  (via drill 0.81)
  Top 0.406: IC7.14 90.17,35.56 90.17,36.2 90.81,36.83 91.44,36.83 92.71,38.1 v92.71,59.05 | v172.72,55.88 v172.72,59.05 | v196.85,46.99 v196.85,55.88
  Bottom 0.406: v172.72,59.05 v92.71,59.05 | v196.85,55.88 v172.72,55.88 | SV1.7 v196.85,46.99
IROW3  (via drill 0.81)
  Top 0.406: v81.28,52.07 IC7.1 | v195.58,44.45 v195.58,52.07
  Bottom 0.406: v81.28,52.07 102.24,52.07 103.51,53.34 145.42,53.34 146.69,52.07 v195.58,52.07 | SV1.9 v195.58,44.45
J1  (via drill 0.81)
  Top 0.406: IC4.2 v45.72,25.4 | v15.88,25.4 14.61,26.67 8.26,26.67 EDGE1.J1
  Bottom 0.406: v45.72,25.4 U$3.J1 v15.88,25.4
J2  (via drill 0.81)
  Top 0.406: IC4.4 40.64,25.4 v39.37,26.67
  Bottom 0.406: EDGE1.J2 8.26,26.67 U$3.J2 v39.37,26.67
K1
  Top 0.406: U$3.K1 8.26,29.21 EDGE1.K1
  Bottom 0.406: IC2.13 41.91,26.67 43.82,26.67 44.45,27.3 44.45,30.48 22.23,30.48 20.96,29.21 U$3.K1
K2
  Bottom 0.406: IC2.14 41.91,29.21 22.23,29.21 20.96,27.94 15.88,27.94 15.24,28.57 | 15.24,28.57 14.61,29.21 8.26,29.21 EDGE1.K2 | U$3.K2 17.15,30.48 15.24,28.57
L1
  Top 0.406: U$3.L1 15.24,31.75 14.61,32.38 8.26,32.38 EDGE1.L1
  Bottom 0.406: IC2.15 45.72,31.75 U$3.L1
L2  (via drill 0.81)
  Top 0.406: v38.1,33.02 IC2.12
  Bottom 0.406: EDGE1.L2 8.26,33.02 U$3.L2 v38.1,33.02
M1
  Top 0.406: U$3.M1 8.26,35.56 EDGE1.M1
  Bottom 0.406: IC2.1 46.99,36.83 22.23,36.83 20.96,35.56 U$3.M1
M2
  Bottom 0.406: IC2.5 36.83,34.29 15.88,34.29 15.24,34.92 | 15.24,34.92 14.61,35.56 8.26,35.56 EDGE1.M2 | U$3.M2 17.15,36.83 15.24,34.92
N1  (via drill 0.81)
  Top 0.406: IC2.2 v45.72,38.1 | v15.88,38.1 14.61,39.37 8.26,39.37 EDGE1.N1
  Bottom 0.406: v45.72,38.1 U$3.N1 v15.88,38.1
N2
  Bottom 0.406: IC2.4 41.91,34.29 48.9,34.29 49.53,34.92 49.53,38.1 47.63,38.1 46.36,39.37 U$3.N2 8.26,39.37 EDGE1.N2
N$1
  Bottom 0.406: IC7.5 85.09,30.48 86.36,31.75 92.71,31.75 IC9.4
N$2
  Top 0.406: IC7.6 80.01,26.67 80.01,22.23 80.65,21.59 92.71,21.59 92.71,34.29 IC9.3
N$3
  Bottom 0.406: IC7.7 80.01,26.67 80.01,31.75 83.19,31.75 88.27,36.83 92.71,36.83 IC9.2
N$4
  Top 0.406: IC1.9 IC1.8
  Bottom 0.406: IC8.6 107.95,26.67 163.83,26.67 IC1.9
N$5
  Bottom 0.406: IC9.5 95.25,31.75 104.78,31.75 106.05,33.02 IC8.4
N$6
  Bottom 0.406: IC9.6 99.7,27.94 100.97,29.21 103.51,29.21 106.05,31.75 107.32,31.75 107.95,32.38 107.95,35.56 IC8.3
N$7
  Top 0.406: IC9.7 96.52,27.94 96.52,45.09 97.16,45.72 105.41,45.72 105.41,39.37 IC8.2
P1  (via drill 0.81)
  Top 0.406: v15.88,41.91 15.24,42.55 8.26,42.55 EDGE1.P1 | v39.37,43.18 40.64,41.91 IC5.13
  Bottom 0.406: v15.88,41.91 U$3.P1 21.59,41.91 22.86,43.18 v39.37,43.18
P2  (via drill 0.81)
  Top 0.406: v21.59,40.64 20.32,41.91 U$3.P2
  Bottom 0.406: U$3.P2 15.24,43.18 14.61,42.55 8.26,42.55 EDGE1.P2 | IC5.14 42.55,40.64 41.28,41.91 22.86,41.91 v21.59,40.64
R1
  Top 0.406: U$3.R1 15.24,44.45 14.61,45.09 8.26,45.09 EDGE1.R1
  Bottom 0.406: IC5.15 43.18,43.18 41.28,43.18 40.01,44.45 U$3.R1
R2  (via drill 0.81)
  Top 0.406: v38.1,45.72 IC5.12
  Bottom 0.406: EDGE1.R2 8.26,45.72 U$3.R2 v38.1,45.72
ROW0  (via drill 0.81)
  Top 0.406: v83.19,26.67 83.19,29.84 83.82,30.48 v83.82,46.99 | v167.64,39.37 v167.64,45.72
  Bottom 0.406: IC7.10 88.27,25.4 87,26.67 v83.19,26.67 | v83.82,46.99 145.42,46.99 146.69,45.72 v167.64,45.72 | v167.64,39.37 172.72,39.37 173.99,40.64 SW1.1
ROW1  (via drill 0.81)
  Top 0.406: v84.46,29.21 85.09,29.84 v85.09,45.72 | v173.99,43.18 v173.99,46.99
  Bottom 0.406: IC7.12 86.36,30.48 85.09,29.21 v84.46,29.21 | v85.09,45.72 145.42,45.72 146.69,44.45 168.28,44.45 170.82,46.99 v173.99,46.99 | SW1.2 v173.99,43.18
ROW2  (via drill 0.81)
  Top 0.406: v97.79,44.45 v97.79,34.92
  Bottom 0.406: IC7.13 89.54,33.02 90.17,33.66 92.08,33.66 92.71,34.29 97.16,34.29 v97.79,34.92 | v97.79,44.45 145.42,44.45 146.69,43.18 169.55,43.18 170.82,44.45 172.09,44.45 173.36,45.72 SW1.3
ROW3  (via drill 0.81)
  Top 0.406: v90.81,38.1 91.44,38.73 v91.44,60.33 | v169.55,60.33 170.18,59.69 v170.18,53.34 | SW1.4 v179.07,53.34
  Bottom 0.406: v90.81,38.1 IC7.15 | v169.55,60.33 v91.44,60.33 | v179.07,53.34 v170.18,53.34
S1
  Top 0.406: U$3.S1 8.26,48.26 EDGE1.S1
  Bottom 0.406: IC5.1 46.99,49.53 22.23,49.53 20.96,48.26 U$3.S1
S2
  Bottom 0.406: IC5.5 36.83,46.99 15.88,46.99 15.24,47.62 | 15.24,47.62 14.61,48.26 8.26,48.26 EDGE1.S2 | U$3.S2 17.15,49.53 15.24,47.62
T1  (via drill 0.81)
  Top 0.406: IC5.2 v45.72,50.8 | v15.88,50.8 14.61,52.07 8.26,52.07 EDGE1.T1
  Bottom 0.406: v45.72,50.8 U$3.T1 v15.88,50.8
T2
  Bottom 0.406: IC5.4 41.91,46.99 48.9,46.99 49.53,47.62 49.53,52.07 U$3.T2 8.26,52.07 EDGE1.T2
U1
  Top 0.406: U$3.U1 8.26,54.61 EDGE1.U1
  Bottom 0.406: IC6.13 39.37,54.61 U$3.U1
U2  (via drill 0.81)
  Top 0.406: IC6.14 41.91,52.07 41.91,20.32 40.64,19.05 39.37,19.05 39.37,13.34 36.83,10.79 36.83,9.53 34.93,7.62 v34.29,7.62 | v28.58,7.62 28.58,15.88 22.86,21.59 22.86,53.34 U$3.U2
  Bottom 0.406: U$3.U2 17.15,55.88 16.51,55.24 8.26,55.24 EDGE1.U2 | v34.29,7.62 v28.58,7.62
V1  (via drill 0.81)
  Top 0.406: v15.88,57.15 14.61,58.42 8.26,58.42 EDGE1.V1 | IC6.15 45.72,55.88 v44.45,57.15
  Bottom 0.406: v15.88,57.15 U$3.V1 v44.45,57.15
V2  (via drill 0.81)
  Top 0.406: v38.1,58.42 IC6.12
  Bottom 0.406: EDGE1.V2 8.26,58.42 U$3.V2 v38.1,58.42
VCC
  Top 0.406: IC3.16 46.99,3.81 46.99,13.97 | IC4.16 46.99,13.97 | 46.99,26.67 IC2.16 | 46.99,13.97 46.99,26.67 | 46.99,39.37 IC5.16 | 46.99,26.67 46.99,39.37 | IC6.16 46.99,52.07 46.99,39.37 | IC7.3 80.01,34.29 | 80.01,34.29 IC12.16 72.39,26.67 72.39,13.97 | 80.01,34.29 74.93,39.37 | 74.93,39.37 IC11.16 | IC10.16 74.93,52.07 74.93,39.37 | IC14.16 72.39,3.81 72.39,13.97 | IC13.16 72.39,13.97
  Bottom 0.406: IC5.16 49.53,39.37 72.39,39.37 IC11.16 | SV1.40 199.39,2.54 196.22,2.54 195.58,1.91 74.3,1.91 IC14.16
VDD
  Top 0.406: IC16.16 165.1,40.64 IC1.14
  Bottom 0.406: IC7.16 90.17,41.91 100.33,41.91 | IC9.16 100.33,41.91 | 113.03,41.91 IC8.16 | 100.33,41.91 113.03,41.91 | 125.73,41.91 IC17.16 | 113.03,41.91 125.73,41.91 | 125.73,41.91 138.43,41.91 IC15.16 140.97,39.37 151.13,39.37 IC16.16
VEE  (via drill 0.81)
  Top 0.406: IC3.7 33.02,10.79 34.29,12.06 34.29,19.05 33.02,20.32 IC4.7 33.02,23.5 34.29,24.77 34.29,31.75 33.02,33.02 IC2.7 33.02,36.2 34.29,37.47 34.29,44.45 33.02,45.72 IC5.7 33.02,48.9 34.29,50.16 34.29,55.88 | IC6.7 33.02,57.15 34.29,55.88 | 34.29,55.88 36.83,58.42 36.83,59.05 37.47,59.69 38.74,59.69 41.91,56.52 v41.91,54.61 | IC14.7 57.15,11.43 57.15,21.59 | IC13.7 57.15,21.59 | 57.15,34.29 IC12.7 | 57.15,21.59 57.15,34.29 | 57.15,46.99 IC11.7 | 57.15,34.29 57.15,46.99 | IC10.7 57.15,59.69 57.15,46.99
  Bottom 0.406: v41.91,54.61 45.09,54.61 46.36,55.88 47.63,55.88 52.71,50.8 55.88,50.8 IC11.7
VSS
  Bottom 0.406: IC7.8 82.55,21.59 92.71,21.59 | IC9.8 92.71,21.59 | 92.71,21.59 105.41,21.59 IC8.8 107.95,24.13 117.48,24.13 118.75,22.86 IC17.8 120.65,21.59 130.81,21.59 | IC15.8 130.81,21.59 | 143.51,21.59 IC16.8 | 130.81,21.59 143.51,21.59 | IC1.7 156.21,21.59 143.51,21.59